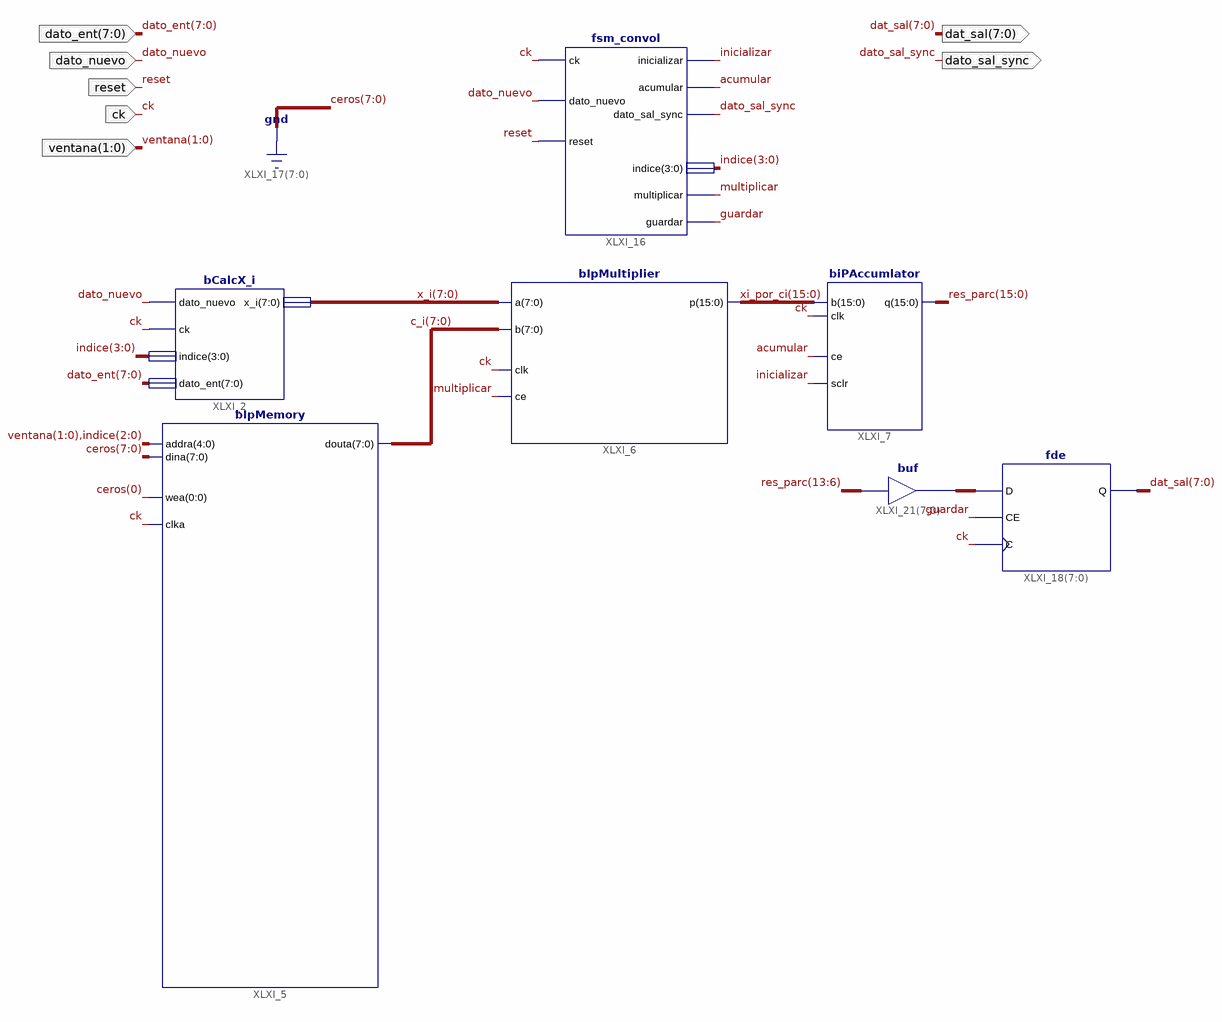
[diagram p0: schematic sheet 1]
// Xilinx ISE schematic bCalcConv.sch (spartan6) as structural Verilog: 7 symbols, 7 ports
module bCalcConv (
  input  dato_nuevo,
  input  ck,
  input  reset,
  input  [7:0] dato_ent,
  input  [1:0] ventana,
  output [7:0] dat_sal,
  output dato_sal_sync
);

  wire acumular, guardar, inicializar, multiplicar;
  wire [3:0] indice;
  wire [7:0] c_i, res_parcl, x_i;
  wire [15:0] res_parc, xi_por_ci;

  bIpMultiplier XLXI_6 (.a(x_i), .b(c_i), .clk(ck), .ce(multiplicar), .p(xi_por_ci));
  biPAccumlator XLXI_7 (.b(xi_por_ci), .clk(ck), .ce(acumular), .sclr(inicializar), .q(res_parc));
  fsm_convol XLXI_16 (
    .ck(ck), .dato_nuevo(dato_nuevo), .reset(reset), .inicializar(inicializar), .acumular(acumular),
    .dato_sal_sync(dato_sal_sync), .multiplicar(multiplicar), .guardar(guardar), .indice(indice));
  fde XLXI_18[7:0] (.C(ck), .CE(guardar), .D(res_parcl), .Q(dat_sal));
  bCalcX_i XLXI_2 (.dato_nuevo(dato_nuevo), .ck(ck), .dato_ent(dato_ent), .indice(indice), .x_i(x_i));
  bIpMemory XLXI_5 (.addra({ventana, indice[2:0]}), .dina({8{1'b0}}), .wea(1'b0), .clka(ck), .douta(c_i));
  assign res_parcl = res_parc[13:6];  // buf XLXI_21[7..0], 8 bits wide
endmodule
